# Altium schematic sheet ACF_INTEGRATOR.SchDoc
size A4; SheetNumber: 7; SheetTotal: 11
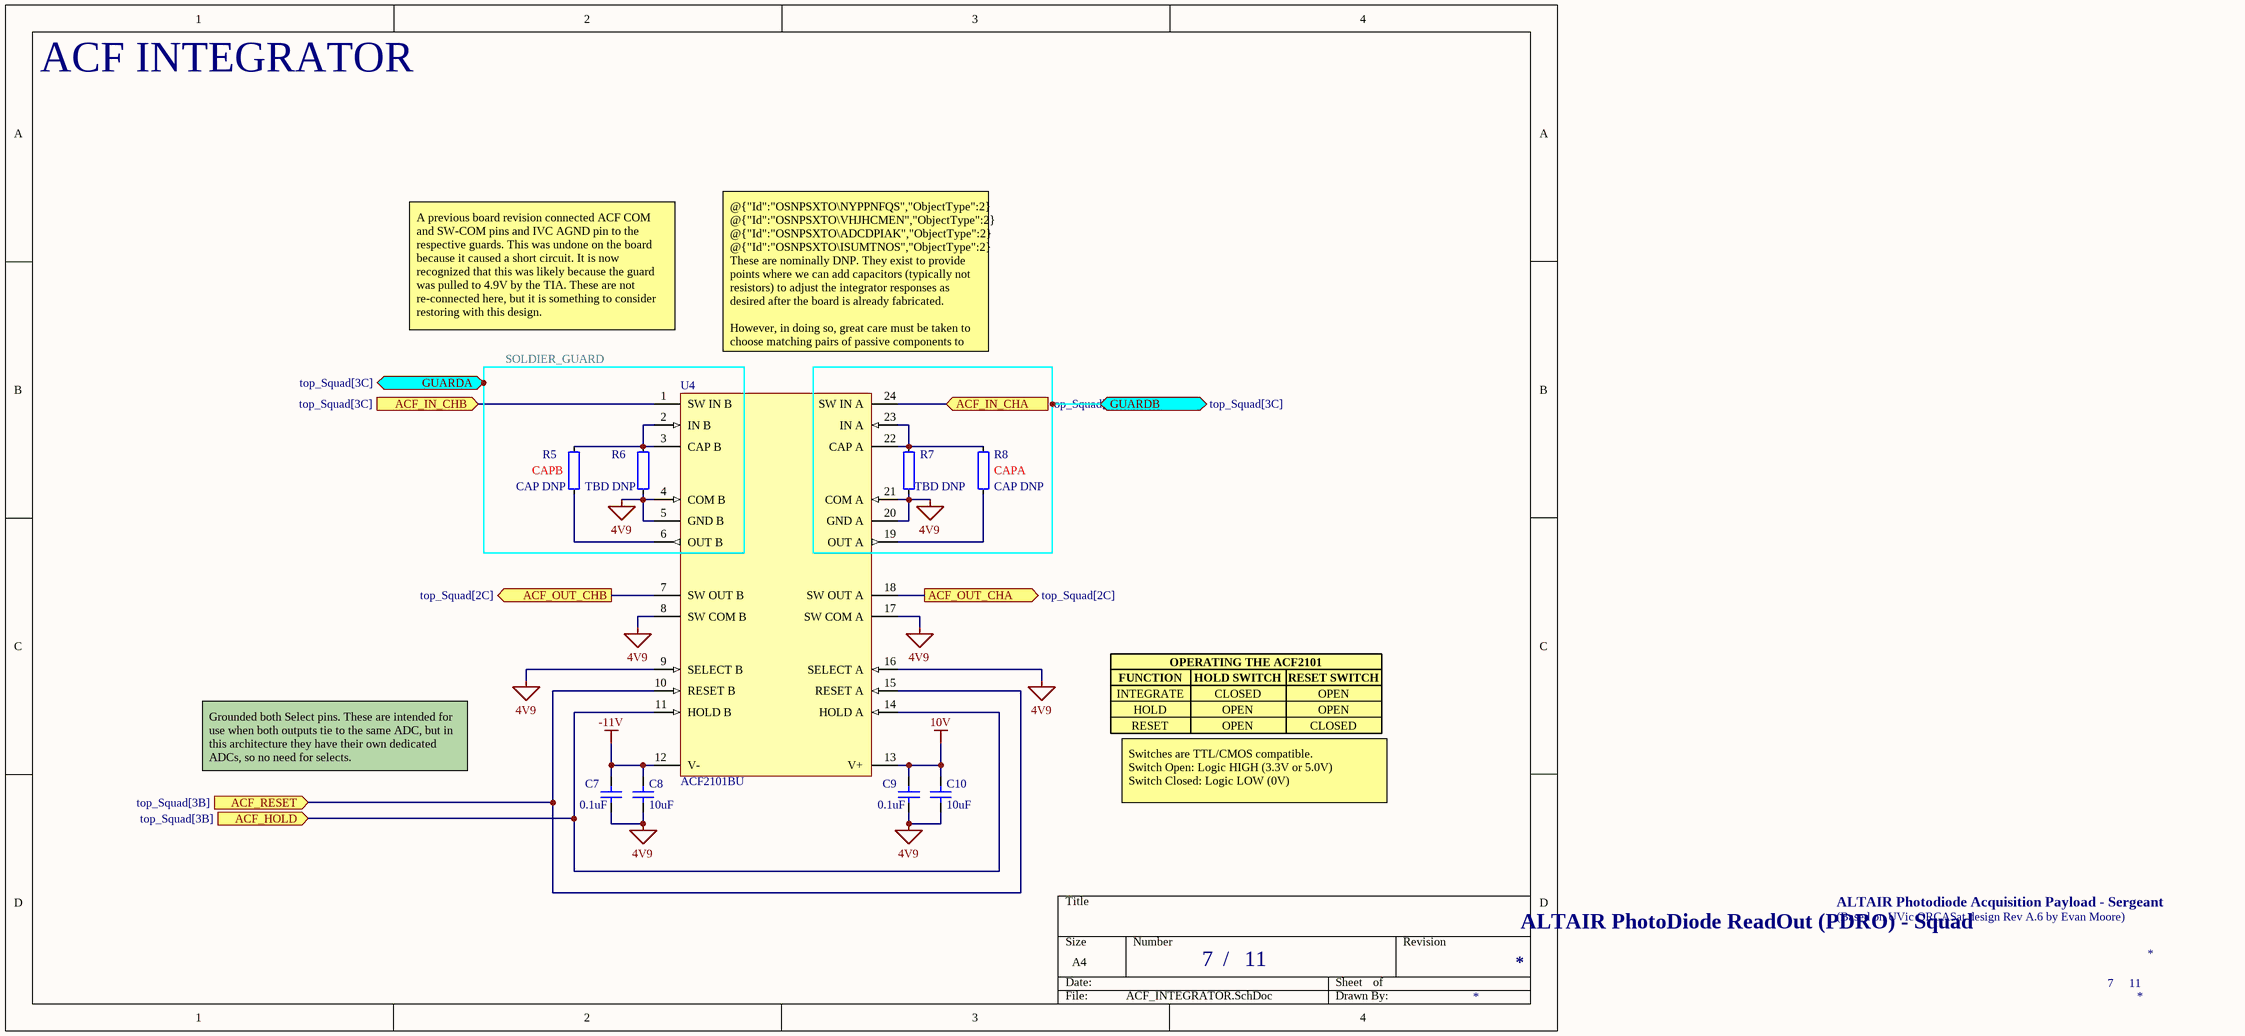
[diagram p0: ACF_INTEGRATOR.SchDoc]

## Parts
C7  0.1uF  [CAP 0603 NON-IPC KEMET X7R]
C8  10uF  [CAP 0805 IPC MID DENSITY]
C9  0.1uF  [CAP 0603 NON-IPC KEMET X7R]
C10  10uF  [CAP 0805 IPC MID DENSITY]
R5  CAP DNP  [CAP 0603 IPC MID DENSITY]
R6  TBD DNP  [CAP 0603 IPC MID DENSITY]
R7  TBD DNP  [CAP 0603 IPC MID DENSITY]
R8  CAP DNP  [CAP 0603 IPC MID DENSITY]
U4  ACF2101BU  [24-SOIC 7.6MM WIDE LOW DENSITY]

## Ports
ACF_HOLD (in, see top_Squad[3B]), ACF_IN_CHA (in, see top_Squad[3C]), ACF_IN_CHB (in, see top_Squad[3C]), ACF_OUT_CHA (out, see top_Squad[2C]), ACF_OUT_CHB (out, see top_Squad[2C]), ACF_RESET (in, see top_Squad[3B]), GUARDA (bidir, see top_Squad[3C]), GUARDB (bidir, see top_Squad[3C])

## Nets
4V9: C7.1 C8.1 C9.1 C10.1 R6.1 R7.1 U4.4(COM_B) U4.5(GND_B) U4.8(SW_COM_B) U4.9(SELECT_B) U4.16(SELECT_A) U4.17(SW_COM_A) U4.20(GND_A) U4.21(COM_A)
10V: C9.2 C10.2 U4.13(V+)
-11V: C7.2 C8.2 U4.12(V-)
ACF_HOLD: U4.11(HOLD_B) U4.14(HOLD_A) ; port ACF_HOLD
ACF_IN_CHA: U4.24(SW_IN_A) ; port ACF_IN_CHA
ACF_IN_CHB: U4.1(SW_IN_B) ; port ACF_IN_CHB
ACF_OUT_CHA: U4.18(SW_OUT_A) ; port ACF_OUT_CHA
ACF_OUT_CHB: U4.7(SW_OUT_B) ; port ACF_OUT_CHB
ACF_RESET: U4.10(RESET_B) U4.15(RESET_A) ; port ACF_RESET
SOLDIER_GUARD: port GUARDA
NetR5_1: R5.1 U4.6(OUT_B)
NetR5_2: R5.2 R6.2 U4.2(IN_B) U4.3(CAP_B)
NetR7_2: R7.2 R8.2 U4.22(CAP_A) U4.23(IN_A)
NetR8_1: R8.1 U4.19(OUT_A)

## Notes on the sheet
- ACF INTEGRATOR
- A previous board revision connected ACF COM and SW-COM pins and IVC AGND pin to the respective guards. This was undone on the board because it caused a short circuit. It is now recognized that this was likely because the guard was pulled to 4.9V by the TIA. These are not re-connected here, but it is something to consider restoring with this design.
- (near U4) @{"Id":"OSNPSXTO\NYPPNFQS","ObjectType":2} @{"Id":"OSNPSXTO\VHJHCMEN","ObjectType":2} @{"Id":"OSNPSXTO\ADCDPIAK","ObjectType":2} @{"Id":"OSNPSXTO\ISUMTNOS","ObjectType":2}
  These are nominally DNP. They exist to provide points where we can add capacitors (typically not resistors) to adjust the integrator responses as desired after the board is already fabricated.
  However, in doing so, great care must be taken to choose matching pairs of passive components to keep the two sides of the integrator as close as possible in response.
- (near R5) CAPB
- (near R8) CAPA
- FUNCTION
- INTEGRATE
- HOLD
- OPERATING THE ACF2101
- HOLD SWITCH
- CLOSED
- OPEN
- RESET SWITCH
- Grounded both Select pins. These are intended for use when both outputs tie to the same ADC, but in this architecture they have their own dedicated ADCs, so no need for selects.
- RESET
- Switches are TTL/CMOS compatible.
  Switch Open: Logic HIGH (3.3V or 5.0V)
  Switch Closed: Logic LOW (0V)
- ALTAIR Photodiode Acquisition Payload - Sergeant
- (Based on UVic ORCASat design Rev A.6 by Evan Moore)
- /
- ALTAIR PhotoDiode ReadOut (PDRO) - Squad

## Library data of the parts
C7 C9 = CAP: Kemet C0603C104K5RACAUTO - Cap Ceramic 0.1uF 50V X7R 10% 0603 125C Paper T/R; MF: Kemet; MP: C0603C104K5RACAUTO
C8 C10 = CAP: Murata GRM21BR61E106KA73L - Cap Ceramic 10uF 10% 25V X5R 0805; MF: Murata; MP: GRM21BR61E106KA73L
R5-R8 = IMPEDANCE: Yageo RC0402JR-070RL - Res 0 Ohms 1/16W SMD 0402; MF: YAGEO; MP: RC0402JR-070RL
U4 = ACF2101BU: Low Noise, Dual Switched Integrator, 14.5 to 36 V, -40 to 125 degC, 24-pin SOIC (DW24), Green (RoHS & no Sb/Br); Iq per channel(Max)(mA): 15; Vio (25C)(Max)(mV): 2; Total Supply Voltage(Max)(+5V is 5, +/-5V is 10): 36; Slew Rate(Typ)(V/us): 3; Rating: Catalog; Packing: TUBE; Sub Family: Precision Amplifier; MF: Texas Instruments; Offset Drift(Typ)(uV/C): 1; Total Supply Voltage(Min)(+5V is 5, +/-5V is 10): 14.5; Code_JEDEC: MS-013; PackageReference: DW0024A; ComponentLink2Description: Datasheet; Eco-Plan: Green (RoHS & no Sb/Br); ComponentLink3Description: Package Specification; ComponentLink2URL: http://www.ti.com/lit/ds/symlink/acf2101.pdf; DatasheetVersion: SBFS003; ComponentLink1URL: http://www.ti.com/; ComponentLink1Description: Manufacturer URL; ComponentLink3URL: http://www.ti.com/litv/pdf/mpds174a; MP: ACF2101BU; PackageVersion: 4040000-5/G, 01/2011; Number of Channels: 2; PackageDescription: 24-Pin Plastic Small Outline, Body 15.4 x 7.5 mm, Pitch 1.27 mm; GBW(Typ)(MHz): 2; Mounting Technology: Surface Mount